# Altium project line-detector.PrjPCB
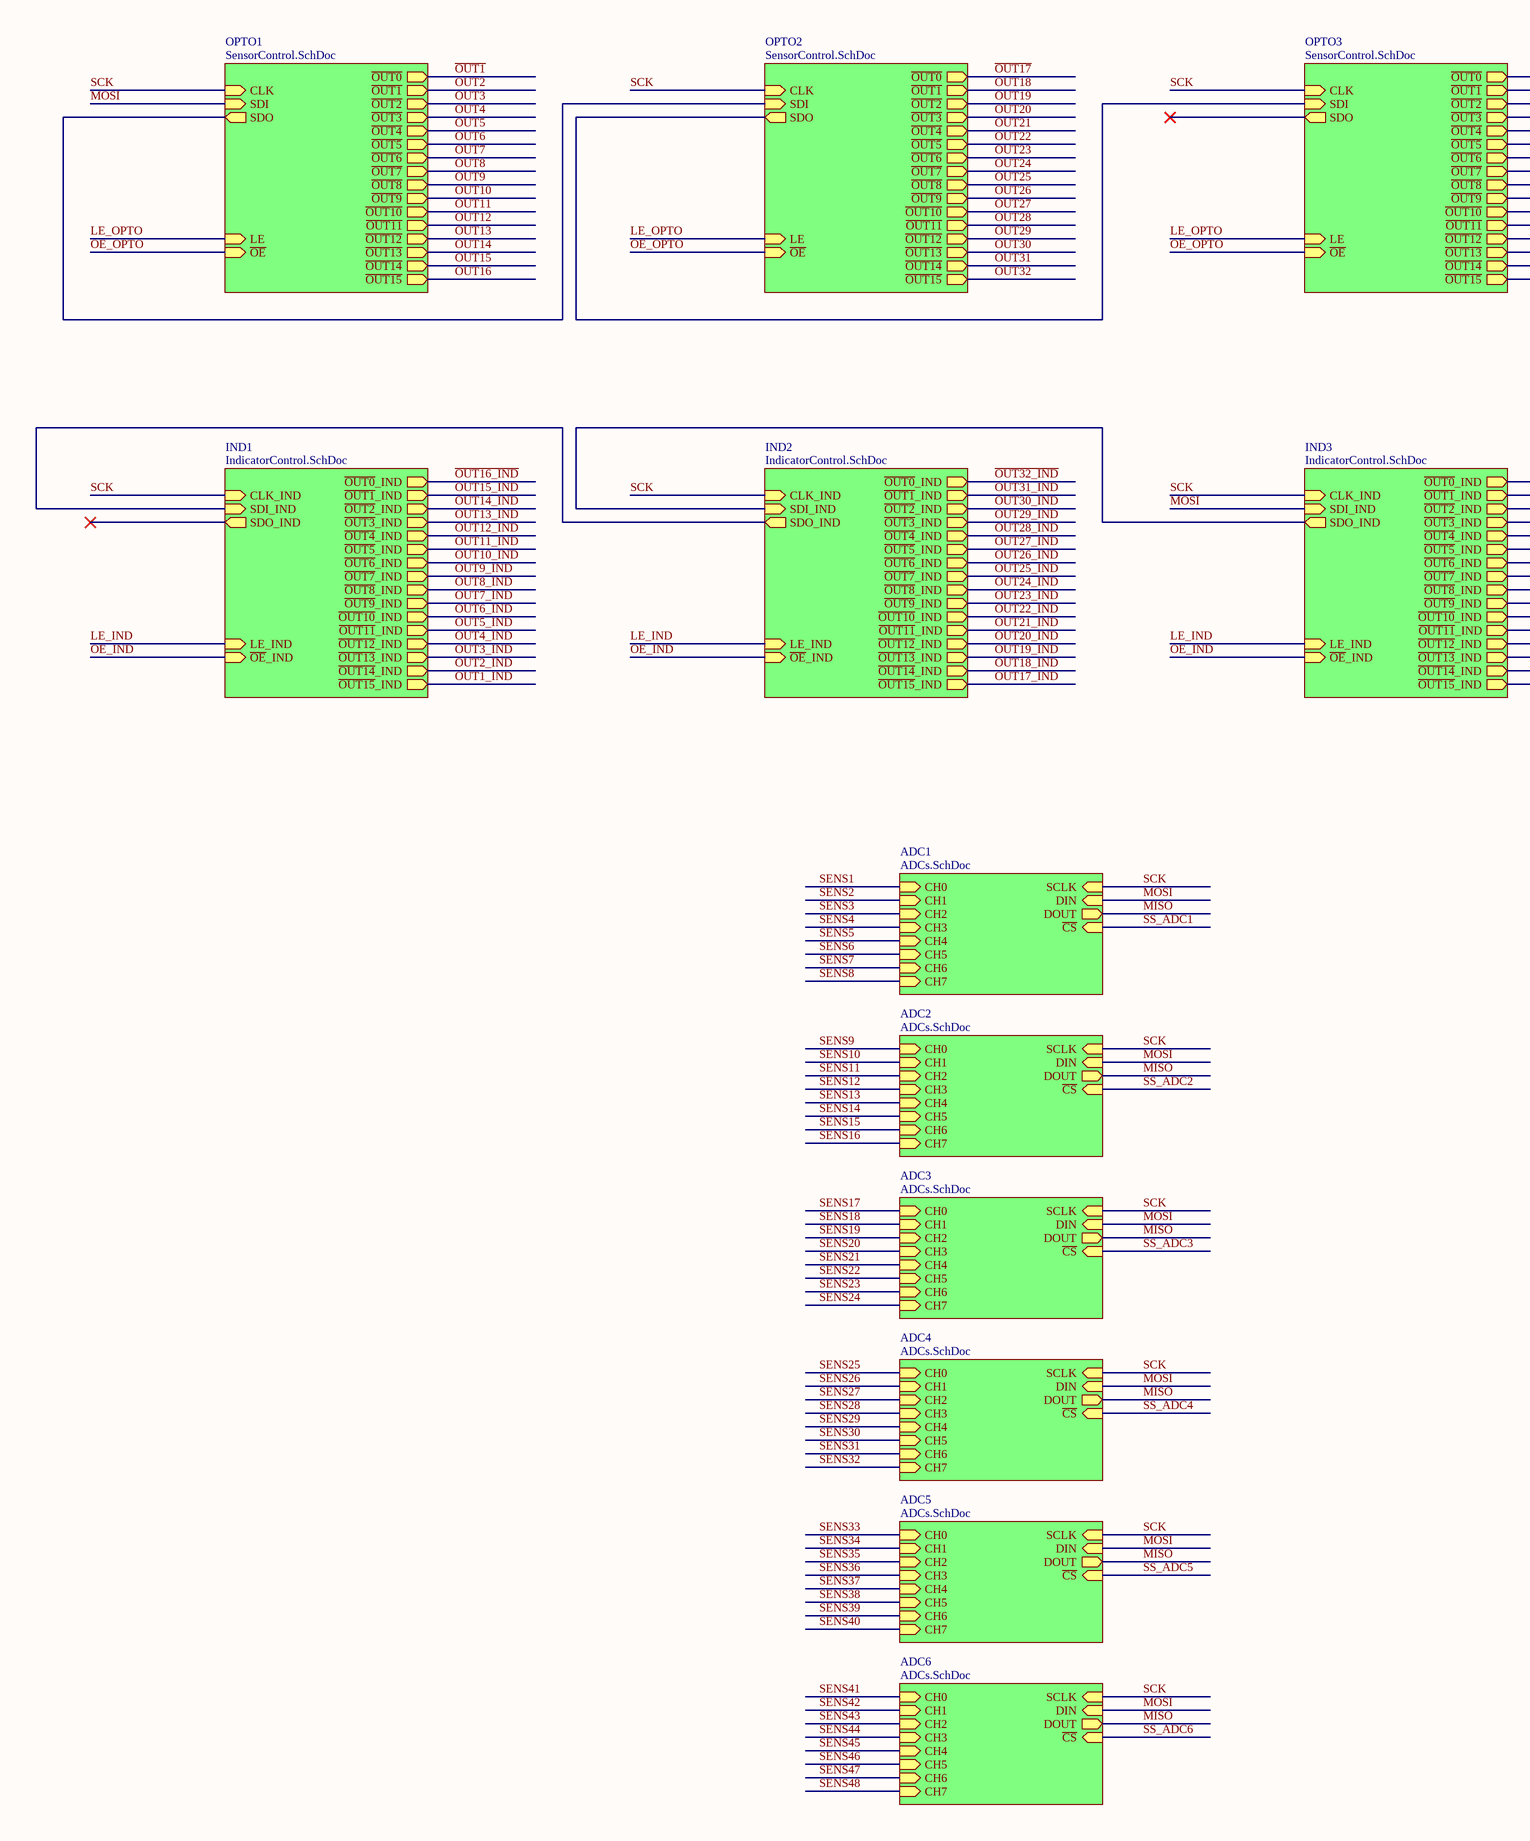
[diagram p0: Main.SchDoc, left]
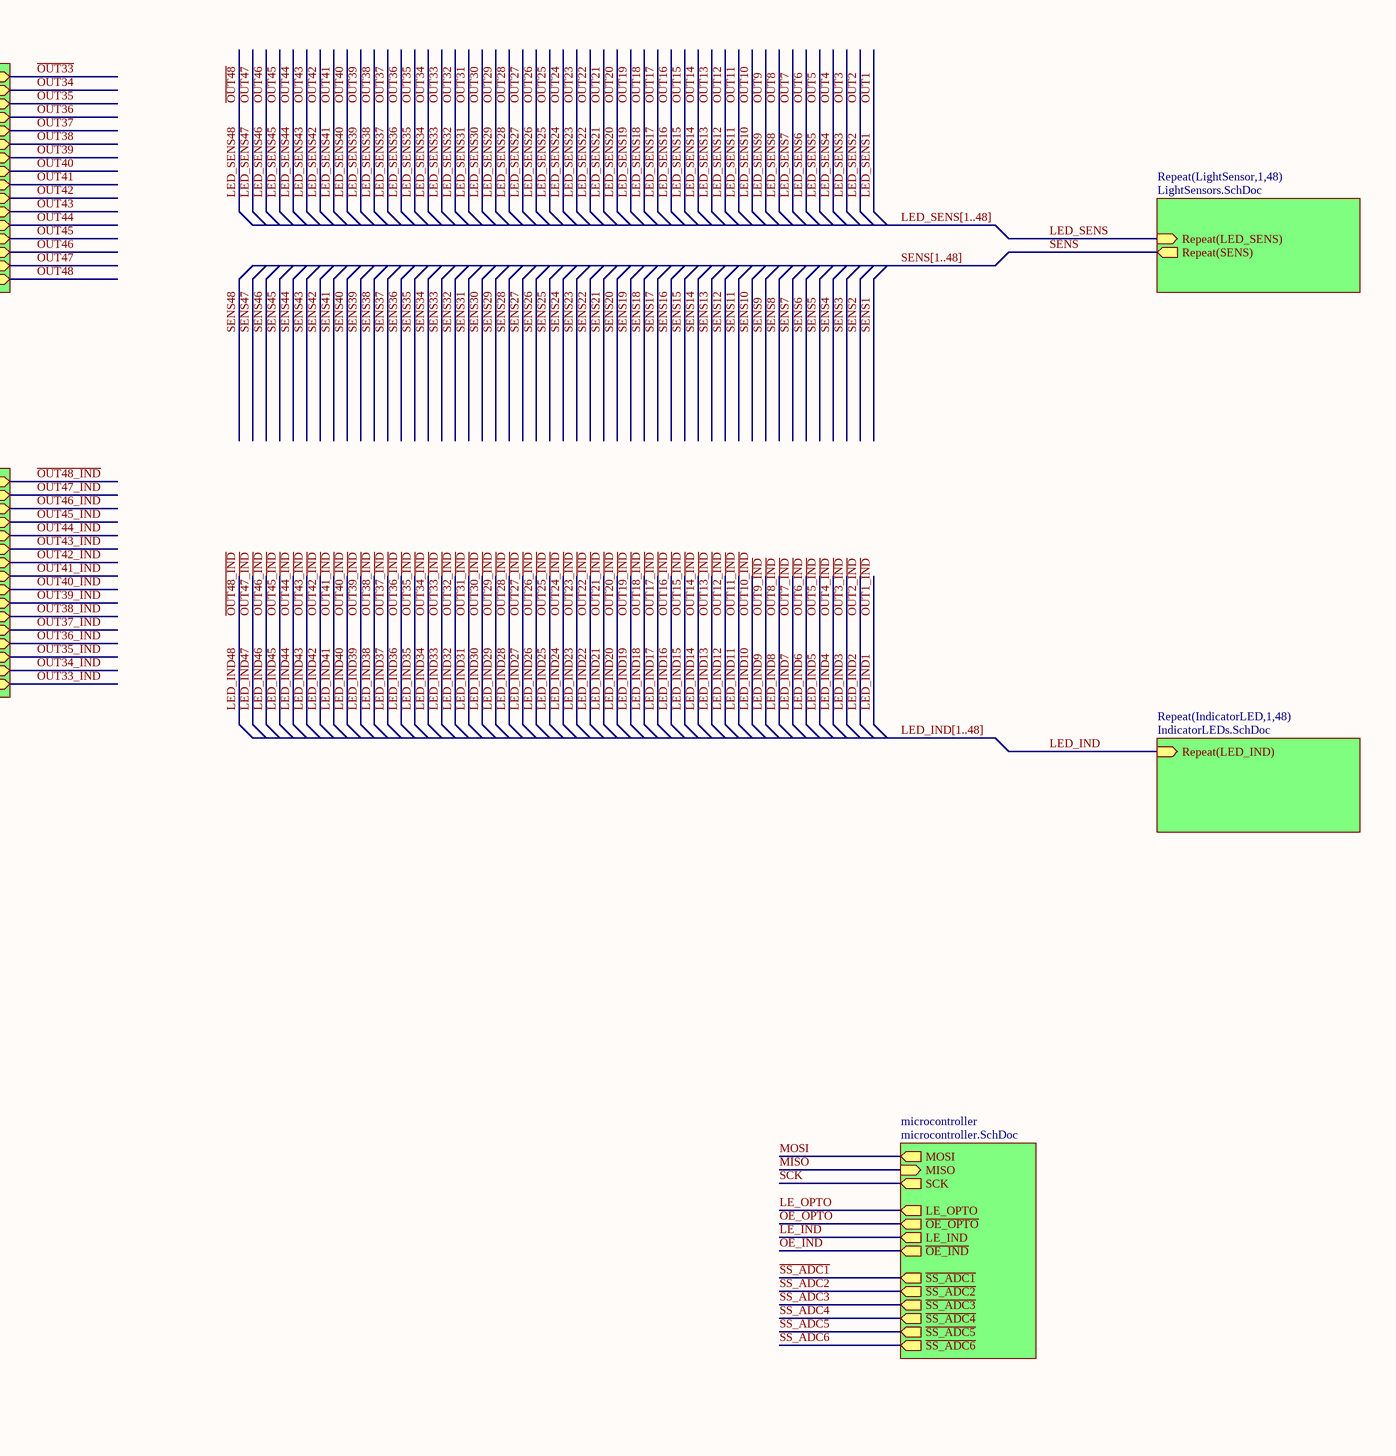
[diagram p1: Main.SchDoc, right]
6 sheets, 161 parts. Net scope: hierarchical (ports join the sheet entries above them; power ports are global).
Board file: Main.PcbDoc
Sheets:
  Main.SchDoc
    OPTO1 = SensorControl.SchDoc
    OPTO2 = SensorControl.SchDoc
    IND1 = IndicatorControl.SchDoc
    IND2 = IndicatorControl.SchDoc
    microcontroller = microcontroller.SchDoc
    ADC1 = ADCs.SchDoc
    ADC2 = ADCs.SchDoc
    ADC3 = ADCs.SchDoc
    ADC4 = ADCs.SchDoc
    LightSensor1 = LightSensors.SchDoc
    LightSensor2 = LightSensors.SchDoc
    LightSensor3 = LightSensors.SchDoc
    LightSensor4 = LightSensors.SchDoc
    LightSensor5 = LightSensors.SchDoc
    LightSensor6 = LightSensors.SchDoc
    LightSensor7 = LightSensors.SchDoc
    LightSensor8 = LightSensors.SchDoc
    LightSensor9 = LightSensors.SchDoc
    LightSensor10 = LightSensors.SchDoc
    LightSensor11 = LightSensors.SchDoc
    LightSensor12 = LightSensors.SchDoc
    LightSensor13 = LightSensors.SchDoc
    LightSensor14 = LightSensors.SchDoc
    LightSensor15 = LightSensors.SchDoc
    LightSensor16 = LightSensors.SchDoc
    LightSensor17 = LightSensors.SchDoc
    LightSensor18 = LightSensors.SchDoc
    LightSensor19 = LightSensors.SchDoc
    LightSensor20 = LightSensors.SchDoc
    LightSensor21 = LightSensors.SchDoc
    LightSensor22 = LightSensors.SchDoc
    LightSensor23 = LightSensors.SchDoc
    LightSensor24 = LightSensors.SchDoc
    LightSensor25 = LightSensors.SchDoc
    LightSensor26 = LightSensors.SchDoc
    LightSensor27 = LightSensors.SchDoc
    LightSensor28 = LightSensors.SchDoc
    LightSensor29 = LightSensors.SchDoc
    LightSensor30 = LightSensors.SchDoc
    LightSensor31 = LightSensors.SchDoc
    LightSensor32 = LightSensors.SchDoc
    LightSensor33 = LightSensors.SchDoc
    LightSensor34 = LightSensors.SchDoc
    LightSensor35 = LightSensors.SchDoc
    LightSensor36 = LightSensors.SchDoc
    LightSensor37 = LightSensors.SchDoc
    LightSensor38 = LightSensors.SchDoc
    LightSensor39 = LightSensors.SchDoc
    LightSensor40 = LightSensors.SchDoc
    LightSensor41 = LightSensors.SchDoc
    LightSensor42 = LightSensors.SchDoc
    LightSensor43 = LightSensors.SchDoc
    LightSensor44 = LightSensors.SchDoc
    LightSensor45 = LightSensors.SchDoc
    LightSensor46 = LightSensors.SchDoc
    LightSensor47 = LightSensors.SchDoc
    LightSensor48 = LightSensors.SchDoc
    OPTO3 = SensorControl.SchDoc
    IND3 = IndicatorControl.SchDoc
    ADC5 = ADCs.SchDoc
    ADC6 = ADCs.SchDoc

## Sheet Main.SchDoc
size A2

### Sub-sheets
ADC1 = ADCs.SchDoc: CH0 (in), CH1 (in), CH2 (in), CH3 (in), CH4 (in), CH5 (in), CH6 (in), CH7 (in), SCLK (in), ~{CS} (in), DIN (in), DOUT (out)
ADC2 = ADCs.SchDoc: CH0 (in), CH1 (in), CH2 (in), CH3 (in), CH4 (in), CH5 (in), CH6 (in), CH7 (in), SCLK (in), ~{CS} (in), DIN (in), DOUT (out)
ADC3 = ADCs.SchDoc: CH0 (in), CH1 (in), CH2 (in), CH3 (in), CH4 (in), CH5 (in), CH6 (in), CH7 (in), SCLK (in), ~{CS} (in), DIN (in), DOUT (out)
ADC4 = ADCs.SchDoc: CH0 (in), CH1 (in), CH2 (in), CH3 (in), CH4 (in), CH5 (in), CH6 (in), CH7 (in), SCLK (in), ~{CS} (in), DIN (in), DOUT (out)
ADC5 = ADCs.SchDoc: CH0 (in), CH1 (in), CH2 (in), CH3 (in), CH4 (in), CH5 (in), CH6 (in), CH7 (in), SCLK (in), ~{CS} (in), DIN (in), DOUT (out)
ADC6 = ADCs.SchDoc: CH0 (in), CH1 (in), CH2 (in), CH3 (in), CH4 (in), CH5 (in), CH6 (in), CH7 (in), SCLK (in), ~{CS} (in), DIN (in), DOUT (out)
IND1 = IndicatorControl.SchDoc: ~{OUT0}_IND (out), ~{OUT1}_IND (out), ~{OUT2}_IND (out), ~{OUT3}_IND (out), ~{OUT4}_IND (out), ~{OUT5}_IND (out), ~{OUT6}_IND (out), ~{OUT7}_IND (out), ~{OUT8}_IND (out), ~{OUT9}_IND (out), ~{OUT10}_IND (out), ~{OUT11}_IND (out), ~{OUT12}_IND (out), ~{OUT13}_IND (out), ~{OUT14}_IND (out), ~{OUT15}_IND (out), SDI_IND (in), ~{OE}_IND (in), CLK_IND (in), LE_IND (in), SDO_IND (out)
IND2 = IndicatorControl.SchDoc: ~{OUT0}_IND (out), ~{OUT1}_IND (out), ~{OUT2}_IND (out), ~{OUT3}_IND (out), ~{OUT4}_IND (out), ~{OUT5}_IND (out), ~{OUT6}_IND (out), ~{OUT7}_IND (out), ~{OUT8}_IND (out), ~{OUT9}_IND (out), ~{OUT10}_IND (out), ~{OUT11}_IND (out), ~{OUT12}_IND (out), ~{OUT13}_IND (out), ~{OUT14}_IND (out), ~{OUT15}_IND (out), SDI_IND (in), ~{OE}_IND (in), CLK_IND (in), LE_IND (in), SDO_IND (out)
IND3 = IndicatorControl.SchDoc: ~{OUT0}_IND (out), ~{OUT1}_IND (out), ~{OUT2}_IND (out), ~{OUT3}_IND (out), ~{OUT4}_IND (out), ~{OUT5}_IND (out), ~{OUT6}_IND (out), ~{OUT7}_IND (out), ~{OUT8}_IND (out), ~{OUT9}_IND (out), ~{OUT10}_IND (out), ~{OUT11}_IND (out), ~{OUT12}_IND (out), ~{OUT13}_IND (out), ~{OUT14}_IND (out), ~{OUT15}_IND (out), SDI_IND (in), ~{OE}_IND (in), CLK_IND (in), LE_IND (in), SDO_IND (out)
microcontroller = microcontroller.SchDoc: LE_IND (out), ~{OE_IND} (out), ~{SS_ADC4} (out), LE_OPTO (out), ~{SS_ADC3} (out), MOSI (out), SCK (out), ~{OE_OPTO} (out), ~{SS_ADC1} (out), ~{SS_ADC2} (out), MISO (in), ~{SS_ADC5} (out), ~{SS_ADC6} (out)
OPTO1 = SensorControl.SchDoc: ~{OUT0} (out), ~{OUT1} (out), ~{OUT2} (out), ~{OUT3} (out), ~{OUT4} (out), ~{OUT5} (out), ~{OUT6} (out), ~{OUT7} (out), ~{OUT8} (out), ~{OUT9} (out), ~{OUT10} (out), ~{OUT11} (out), ~{OUT12} (out), ~{OUT13} (out), ~{OUT14} (out), ~{OUT15} (out), SDI (in), ~{OE} (in), CLK (in), LE (in), SDO (out)
OPTO2 = SensorControl.SchDoc: ~{OUT0} (out), ~{OUT1} (out), ~{OUT2} (out), ~{OUT3} (out), ~{OUT4} (out), ~{OUT5} (out), ~{OUT6} (out), ~{OUT7} (out), ~{OUT8} (out), ~{OUT9} (out), ~{OUT10} (out), ~{OUT11} (out), ~{OUT12} (out), ~{OUT13} (out), ~{OUT14} (out), ~{OUT15} (out), SDI (in), ~{OE} (in), CLK (in), LE (in), SDO (out)
OPTO3 = SensorControl.SchDoc: ~{OUT0} (out), ~{OUT1} (out), ~{OUT2} (out), ~{OUT3} (out), ~{OUT4} (out), ~{OUT5} (out), ~{OUT6} (out), ~{OUT7} (out), ~{OUT8} (out), ~{OUT9} (out), ~{OUT10} (out), ~{OUT11} (out), ~{OUT12} (out), ~{OUT13} (out), ~{OUT14} (out), ~{OUT15} (out), SDI (in), ~{OE} (in), CLK (in), LE (in), SDO (out)
Repeat(IndicatorLED,1,48) = IndicatorLEDs.SchDoc (file not in this document): Repeat(LED_IND) (in)
Repeat(LightSensor,1,48) = LightSensors.SchDoc: Repeat(SENS) (out), Repeat(LED_SENS) (in)

### Nets
LE_IND: sheet IND1/LE_IND, sheet IND2/LE_IND, sheet microcontroller/LE_IND, sheet IND3/LE_IND
LE_OPTO: sheet OPTO1/LE, sheet OPTO2/LE, sheet microcontroller/LE_OPTO, sheet OPTO3/LE
LED_IND: sheet Repeat(IndicatorLED,1,48)/Repeat(LED_IND)
LED_SENS: sheet Repeat(LightSensor,1,48)/Repeat(LED_SENS)
MISO: sheet microcontroller/MISO, sheet ADC1/DOUT, sheet ADC2/DOUT, sheet ADC3/DOUT, sheet ADC4/DOUT, sheet ADC5/DOUT, sheet ADC6/DOUT
MOSI: sheet OPTO1/SDI, sheet microcontroller/MOSI, sheet ADC1/DIN, sheet ADC2/DIN, sheet ADC3/DIN, sheet ADC4/DIN, sheet IND3/SDI_IND, sheet ADC5/DIN, sheet ADC6/DIN
~{OE_IND}: sheet IND1/~{OE}_IND, sheet IND2/~{OE}_IND, sheet microcontroller/~{OE_IND}, sheet IND3/~{OE}_IND
~{OE_OPTO}: sheet OPTO1/~{OE}, sheet OPTO2/~{OE}, sheet microcontroller/~{OE_OPTO}, sheet OPTO3/~{OE}
~{SS_ADC1}: sheet microcontroller/~{SS_ADC1}, sheet ADC1/~{CS}
~{SS_ADC2}: sheet microcontroller/~{SS_ADC2}, sheet ADC2/~{CS}
~{SS_ADC3}: sheet microcontroller/~{SS_ADC3}, sheet ADC3/~{CS}
~{SS_ADC4}: sheet microcontroller/~{SS_ADC4}, sheet ADC4/~{CS}
~{SS_ADC5}: sheet microcontroller/~{SS_ADC5}, sheet ADC5/~{CS}
~{SS_ADC6}: sheet microcontroller/~{SS_ADC6}, sheet ADC6/~{CS}
SCK: sheet OPTO1/CLK, sheet OPTO2/CLK, sheet IND1/CLK_IND, sheet IND2/CLK_IND, sheet microcontroller/SCK, sheet ADC1/SCLK, sheet ADC2/SCLK, sheet ADC3/SCLK, sheet ADC4/SCLK, sheet OPTO3/CLK, sheet IND3/CLK_IND, sheet ADC5/SCLK, sheet ADC6/SCLK
SENS: sheet Repeat(LightSensor,1,48)/Repeat(SENS)
NetIND1_2: sheet IND1/SDI_IND, sheet IND2/SDO_IND
NetIND2_2: sheet IND2/SDI_IND, sheet IND3/SDO_IND
NetOPTO1_22: sheet OPTO1/SDO, sheet OPTO2/SDI
NetOPTO2_22: sheet OPTO2/SDO, sheet OPTO3/SDI

### Buses and harness runs
bus LED_IND[1..48]
bus LED_SENS[1..48]
bus SENS[1..48]

## Sheet SensorControl.SchDoc
size A4
Used 3 times, as channels OPTO1, OPTO2, OPTO3. Parts and nets are listed once, with the designators drawn on the sheet.
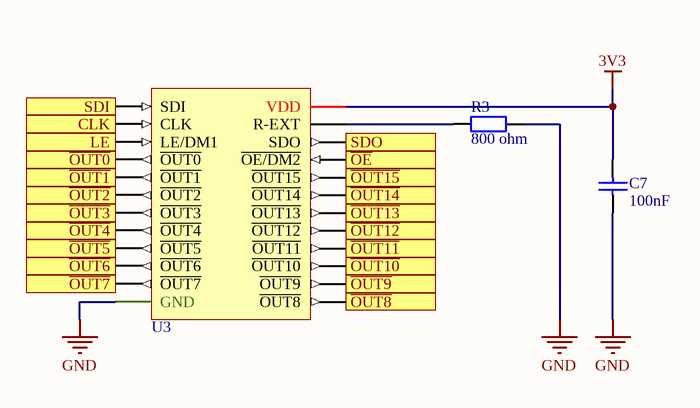
[diagram p2: SensorControl.SchDoc]

### Parts
C7  100nF  [FP_0805_CAP_085]
R3  Resistance: 800 ohm  [0805-W]  (hidden comment: CRCW0805806RFKEA)
U3  STP16CP05TTR  [24-Pin TSSOP]  (value not drawn)

### Ports
CLK (in), LE (in), SDI (in), SDO (out), ~{OE} (in), ~{OUT0} (out), ~{OUT1} (out), ~{OUT2} (out), ~{OUT3} (out), ~{OUT4} (out), ~{OUT5} (out), ~{OUT6} (out), ~{OUT7} (out), ~{OUT8} (out), ~{OUT9} (out), ~{OUT10} (out), ~{OUT11} (out), ~{OUT12} (out), ~{OUT13} (out), ~{OUT14} (out), ~{OUT15} (out)

### Nets
3V3: C7.2 U3.24(VDD)
GND: C7.1 R3.2 U3.1(GND)
CLK: U3.3(CLK) ; port CLK
LE: U3.4(LE/DM1) ; port LE
~{OE}: U3.21(~{OE/DM2}) ; port ~{OE}
~{OUT0}: U3.5(~{OUT0}) ; port ~{OUT0}
~{OUT1}: U3.6(~{OUT1}) ; port ~{OUT1}
~{OUT10}: U3.15(~{OUT10}) ; port ~{OUT10}
~{OUT11}: U3.16(~{OUT11}) ; port ~{OUT11}
~{OUT12}: U3.17(~{OUT12}) ; port ~{OUT12}
~{OUT13}: U3.18(~{OUT13}) ; port ~{OUT13}
~{OUT14}: U3.19(~{OUT14}) ; port ~{OUT14}
~{OUT15}: U3.20(~{OUT15}) ; port ~{OUT15}
~{OUT2}: U3.7(~{OUT2}) ; port ~{OUT2}
~{OUT3}: U3.8(~{OUT3}) ; port ~{OUT3}
~{OUT4}: U3.9(~{OUT4}) ; port ~{OUT4}
~{OUT5}: U3.10(~{OUT5}) ; port ~{OUT5}
~{OUT6}: U3.11(~{OUT6}) ; port ~{OUT6}
~{OUT7}: U3.12(~{OUT7}) ; port ~{OUT7}
~{OUT8}: U3.13(~{OUT8}) ; port ~{OUT8}
~{OUT9}: U3.14(~{OUT9}) ; port ~{OUT9}
SDI: U3.2(SDI) ; port SDI
SDO: U3.22(SDO) ; port SDO
NetR3_1: R3.1 U3.23(R-EXT)

### Channels
OPTO1: designators C7=C7#1 R3=R3#1 U3=OPTO1; ports CLK=SCK LE=LE_OPTO SDI=MOSI SDO=NetOPTO1_22 ~{OE}=~{OE_OPTO} ~{OUT0}=LED_SENS1 ~{OUT1}=LED_SENS2 ~{OUT2}=LED_SENS3 ~{OUT3}=LED_SENS4 ~{OUT4}=LED_SENS5 ~{OUT5}=LED_SENS6 ~{OUT6}=LED_SENS7 ~{OUT7}=LED_SENS8 ~{OUT8}=LED_SENS9 ~{OUT9}=LED_SENS10 ~{OUT10}=LED_SENS11 ~{OUT11}=LED_SENS12 ~{OUT12}=LED_SENS13 ~{OUT13}=LED_SENS14 ~{OUT14}=LED_SENS15 ~{OUT15}=LED_SENS16
OPTO2: designators C7=C7#2 R3=R3#2 U3=OPTO2; ports CLK=SCK LE=LE_OPTO SDI=NetOPTO1_22 SDO=NetOPTO2_22 ~{OE}=~{OE_OPTO} ~{OUT0}=LED_SENS17 ~{OUT1}=LED_SENS18 ~{OUT2}=LED_SENS19 ~{OUT3}=LED_SENS20 ~{OUT4}=LED_SENS21 ~{OUT5}=LED_SENS22 ~{OUT6}=LED_SENS23 ~{OUT7}=LED_SENS24 ~{OUT8}=LED_SENS25 ~{OUT9}=LED_SENS26 ~{OUT10}=LED_SENS27 ~{OUT11}=LED_SENS28 ~{OUT12}=LED_SENS29 ~{OUT13}=LED_SENS30 ~{OUT14}=LED_SENS31 ~{OUT15}=LED_SENS32
OPTO3: designators C7=C7#3 R3=R3#3 U3=OPTO3; ports CLK=SCK LE=LE_OPTO SDI=NetOPTO2_22 SDO=NetOPTO3_22 ~{OE}=~{OE_OPTO} ~{OUT0}=LED_SENS33 ~{OUT1}=LED_SENS34 ~{OUT2}=LED_SENS35 ~{OUT3}=LED_SENS36 ~{OUT4}=LED_SENS37 ~{OUT5}=LED_SENS38 ~{OUT6}=LED_SENS39 ~{OUT7}=LED_SENS40 ~{OUT8}=LED_SENS41 ~{OUT9}=LED_SENS42 ~{OUT10}=LED_SENS43 ~{OUT11}=LED_SENS44 ~{OUT12}=LED_SENS45 ~{OUT13}=LED_SENS46 ~{OUT14}=LED_SENS47 ~{OUT15}=LED_SENS48

### Library data of the parts
C7 = CAP 100nF: Capacitor; Tolerance: +80%/-20%; Voltage: 25V; Reference: 1759167; Name: SMD Multilayer Ceramic Capacitor, 0805; Supplier: Farnell; Value: 100nF
R3 = CRCW0805806RFKEA: RES, THICK FILM, 806R, 1%, 0.125W, 0805
U3 = STP16CP05TTR: Led Driver, 16 Outputs, Constant Current, 3V-5.5V in, 30MHz switch, 20V/100mA out, TSSOP-24

## Sheet IndicatorControl.SchDoc
size A4
Used 3 times, as channels IND1, IND2, IND3. Parts and nets are listed once, with the designators drawn on the sheet.
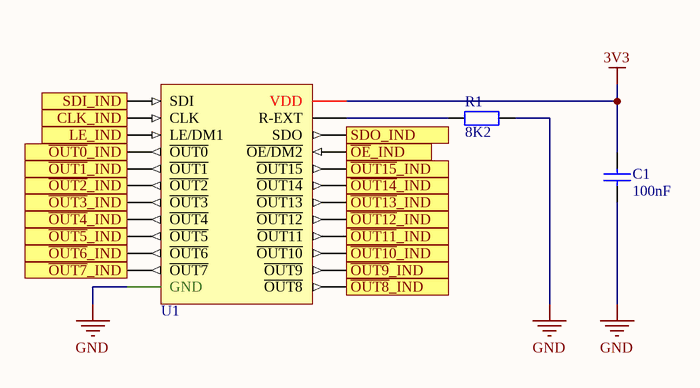
[diagram p3: IndicatorControl.SchDoc]

### Parts
C1  100nF  [FP_0805_CAP_085]
R1  8K2  [FP_0805_RES]
U1  STP16CP05TTR  [24-Pin TSSOP]  (value not drawn)

### Ports
CLK_IND (in), LE_IND (in), SDI_IND (in), SDO_IND (out), ~{OE}_IND (in), ~{OUT0}_IND (out), ~{OUT1}_IND (out), ~{OUT2}_IND (out), ~{OUT3}_IND (out), ~{OUT4}_IND (out), ~{OUT5}_IND (out), ~{OUT6}_IND (out), ~{OUT7}_IND (out), ~{OUT8}_IND (out), ~{OUT9}_IND (out), ~{OUT10}_IND (out), ~{OUT11}_IND (out), ~{OUT12}_IND (out), ~{OUT13}_IND (out), ~{OUT14}_IND (out), ~{OUT15}_IND (out)

### Nets
3V3: C1.2 U1.24(VDD)
GND: C1.1 R1.2 U1.1(GND)
CLK_IND: U1.3(CLK) ; port CLK_IND
LE_IND: U1.4(LE/DM1) ; port LE_IND
~{OE}_IND: U1.21(~{OE/DM2}) ; port ~{OE}_IND
~{OUT0}_IND: U1.5(~{OUT0}) ; port ~{OUT0}_IND
~{OUT10}_IND: U1.15(~{OUT10}) ; port ~{OUT10}_IND
~{OUT11}_IND: U1.16(~{OUT11}) ; port ~{OUT11}_IND
~{OUT12}_IND: U1.17(~{OUT12}) ; port ~{OUT12}_IND
~{OUT13}_IND: U1.18(~{OUT13}) ; port ~{OUT13}_IND
~{OUT14}_IND: U1.19(~{OUT14}) ; port ~{OUT14}_IND
~{OUT15}_IND: U1.20(~{OUT15}) ; port ~{OUT15}_IND
~{OUT1}_IND: U1.6(~{OUT1}) ; port ~{OUT1}_IND
~{OUT2}_IND: U1.7(~{OUT2}) ; port ~{OUT2}_IND
~{OUT3}_IND: U1.8(~{OUT3}) ; port ~{OUT3}_IND
~{OUT4}_IND: U1.9(~{OUT4}) ; port ~{OUT4}_IND
~{OUT5}_IND: U1.10(~{OUT5}) ; port ~{OUT5}_IND
~{OUT6}_IND: U1.11(~{OUT6}) ; port ~{OUT6}_IND
~{OUT7}_IND: U1.12(~{OUT7}) ; port ~{OUT7}_IND
~{OUT8}_IND: U1.13(~{OUT8}) ; port ~{OUT8}_IND
~{OUT9}_IND: U1.14(~{OUT9}) ; port ~{OUT9}_IND
SDI_IND: U1.2(SDI) ; port SDI_IND
SDO_IND: U1.22(SDO) ; port SDO_IND
NetR1_1: R1.1 U1.23(R-EXT)

### Channels
IND1: designators C1=C1#1 R1=R1#1 U1=IND1; ports CLK_IND=SCK LE_IND=LE_IND SDI_IND=NetIND1_2 SDO_IND=NetIND1_22 ~{OE}_IND=~{OE_IND} ~{OUT0}_IND=LED_IND16 ~{OUT1}_IND=LED_IND15 ~{OUT2}_IND=LED_IND14 ~{OUT3}_IND=LED_IND13 ~{OUT4}_IND=LED_IND12 ~{OUT5}_IND=LED_IND11 ~{OUT6}_IND=LED_IND10 ~{OUT7}_IND=LED_IND9 ~{OUT8}_IND=LED_IND8 ~{OUT9}_IND=LED_IND7 ~{OUT10}_IND=LED_IND6 ~{OUT11}_IND=LED_IND5 ~{OUT12}_IND=LED_IND4 ~{OUT13}_IND=LED_IND3 ~{OUT14}_IND=LED_IND2 ~{OUT15}_IND=LED_IND1
IND2: designators C1=C1#2 R1=R1#2 U1=IND2; ports CLK_IND=SCK LE_IND=LE_IND SDI_IND=NetIND2_2 SDO_IND=NetIND1_2 ~{OE}_IND=~{OE_IND} ~{OUT0}_IND=LED_IND32 ~{OUT1}_IND=LED_IND31 ~{OUT2}_IND=LED_IND30 ~{OUT3}_IND=LED_IND29 ~{OUT4}_IND=LED_IND28 ~{OUT5}_IND=LED_IND27 ~{OUT6}_IND=LED_IND26 ~{OUT7}_IND=LED_IND25 ~{OUT8}_IND=LED_IND24 ~{OUT9}_IND=LED_IND23 ~{OUT10}_IND=LED_IND22 ~{OUT11}_IND=LED_IND21 ~{OUT12}_IND=LED_IND20 ~{OUT13}_IND=LED_IND19 ~{OUT14}_IND=LED_IND18 ~{OUT15}_IND=LED_IND17
IND3: designators C1=C1#3 R1=R1#3 U1=IND3; ports CLK_IND=SCK LE_IND=LE_IND SDI_IND=MOSI SDO_IND=NetIND2_2 ~{OE}_IND=~{OE_IND} ~{OUT0}_IND=LED_IND48 ~{OUT1}_IND=LED_IND47 ~{OUT2}_IND=LED_IND46 ~{OUT3}_IND=LED_IND45 ~{OUT4}_IND=LED_IND44 ~{OUT5}_IND=LED_IND43 ~{OUT6}_IND=LED_IND42 ~{OUT7}_IND=LED_IND41 ~{OUT8}_IND=LED_IND40 ~{OUT9}_IND=LED_IND39 ~{OUT10}_IND=LED_IND38 ~{OUT11}_IND=LED_IND37 ~{OUT12}_IND=LED_IND36 ~{OUT13}_IND=LED_IND35 ~{OUT14}_IND=LED_IND34 ~{OUT15}_IND=LED_IND33

### Library data of the parts
C1 = CAP 100nF: as C7 on sheet SensorControl; Supplier: Farnell; Value: 100nF
R1 = RES 8K2: Resistor; Tolerance: 5%; Power: 125mW; Name: YAGEO (PHYCOMP)  RC0805JR-078K2L  SMD Chip Resistor, Thick Film, 8.2 kohm; Reference: 9234128; Supplier: Farnell; Value: 8K2
U1 = STP16CP05TTR: as U3 on sheet SensorControl

## Sheet microcontroller.SchDoc
size A
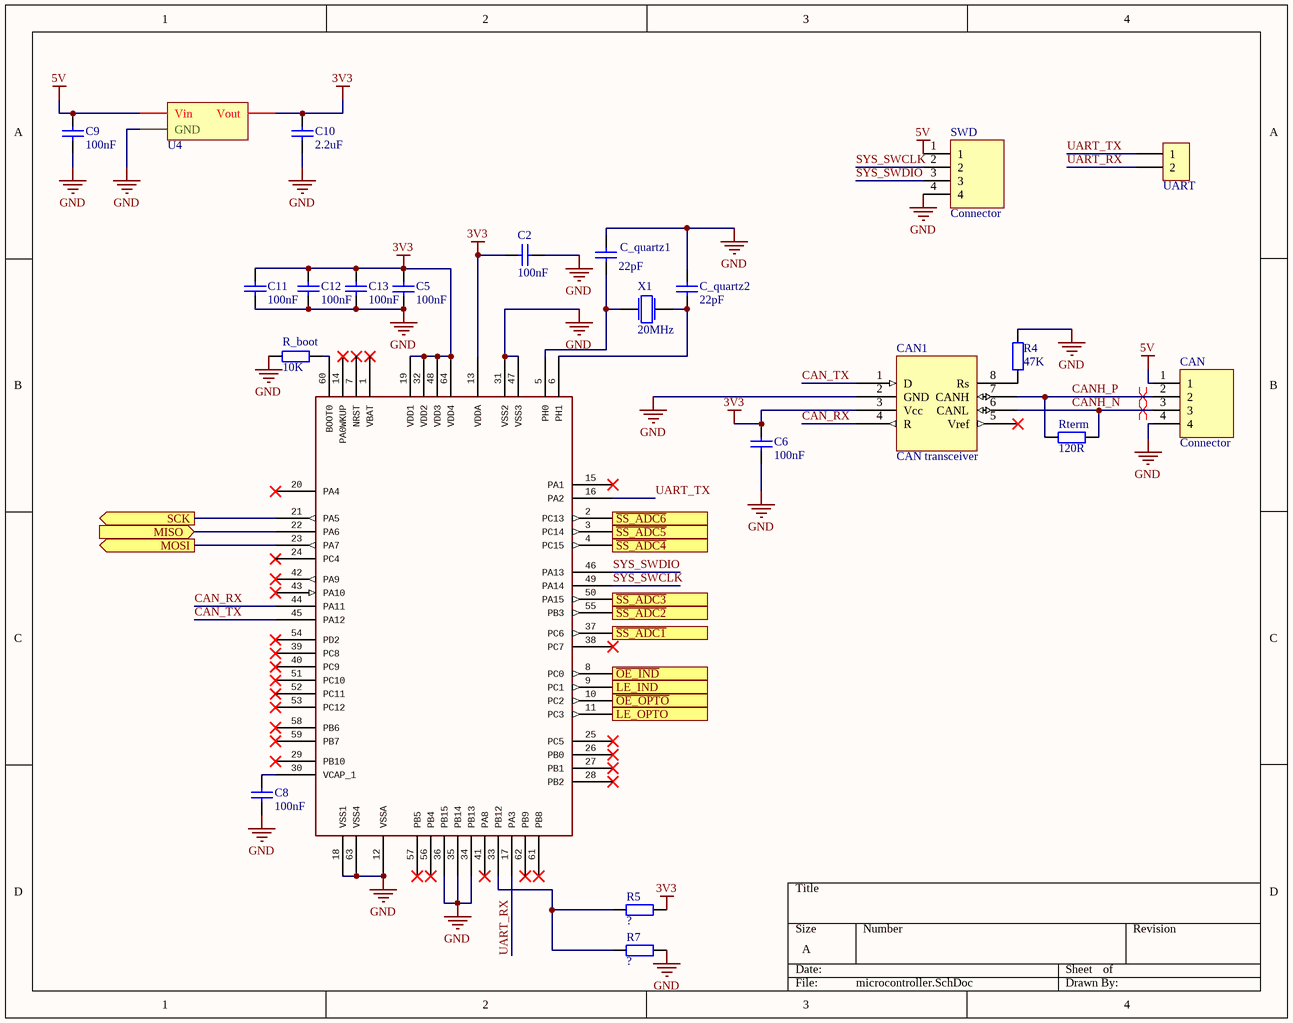
[diagram p4: microcontroller.SchDoc]

### Parts
(Parts that share a designator on the sheet are numbered #1, #2 ... from top to bottom, then left to right.)
1#1  64-pin STM32F4 chip with symbol for Foxcar Control Board v1.  [LQFP64]  (value not drawn)
C2  100nF  [FP_0805_CAP_085]
C5  100nF  [FP_0805_CAP_085]
C6  100nF  [FP_0805_CAP_085]
C8  100nF  [FP_0805_CAP_085]
C9  100nF  [FP_0805_CAP_085]
C10  2.2uF  [FP_0805_CAP_085]
C11  100nF  [FP_0805_CAP_085]
C12  100nF  [FP_0805_CAP_085]
C13  100nF  [FP_0805_CAP_085]
C_quartz1  22pF  [FP_0805_CAP_085]
C_quartz2  22pF  [FP_0805_CAP_085]
CAN  Connector  [FP_CONN4_TUSKE_254MM]
CAN1  CAN transceiver  [SOIC-8]
R4  47K  [FP_0805_RES]
R5  0Ohm  [FP_0805_RES]  (value not drawn)
R7  0Ohm  [FP_0805_RES]  (value not drawn)
R_boot  10K  [FP_0805_RES]
Rterm  120R  [FP_0805_RES]
SWD  Connector  [FP_CONN4_TUSKE_254MM]
U4  LF33CDT-TRY  [DPAK]  (value not drawn)
UART  2-Pin HEADER  [2-Pin Header]  (value not drawn)
X1  20MHz  [FP_CRYSTAL_HC49_SMD]

### Ports
LE_IND (out), LE_OPTO (out), MISO (in), MOSI (out), SCK (out), ~{OE_IND} (out), ~{OE_OPTO} (out), ~{SS_ADC1} (out), ~{SS_ADC2} (out), ~{SS_ADC3} (out), ~{SS_ADC4} (out), ~{SS_ADC5} (out), ~{SS_ADC6} (out)

### Nets
3V3: 1#1.13(VDDA) 1#1.19(VDD1) 1#1.32(VDD2) 1#1.48(VDD3) 1#1.64(VDD4) C2.2 C5.2 C6.1 C10.2 C11.2 C12.2 C13.2 CAN1.3(Vcc) R5.2 U4.S(Vout)
5V: C9.2 CAN.1 SWD.1 U4.G(Vin)
GND: 1#1.12(VSSA) 1#1.18(VSS1) 1#1.31(VSS2) 1#1.34(PB13) 1#1.35(PB14) 1#1.36(PB15) 1#1.47(VSS3) 1#1.63(VSS4) C2.1 C5.1 C6.2 C8.1 C9.1 C10.1 C11.1 C12.1 C13.1 C_quartz1.1 C_quartz2.1 CAN.4 CAN1.2(GND) R4.2 R7.2 R_boot.1 SWD.4 U4.D(GND)
CAN_RX: 1#1.44(PA11) CAN1.4(R)
CAN_TX: 1#1.45(PA12) CAN1.1(D)
CANH_N: CAN.3 CAN1.6(CANL) Rterm.2
CANH_P: CAN.2 CAN1.7(CANH) Rterm.1
LE_IND: 1#1.9(PC1) ; port LE_IND
LE_OPTO: 1#1.11(PC3) ; port LE_OPTO
MISO: 1#1.22(PA6) ; port MISO
MOSI: 1#1.23(PA7) ; port MOSI
~{OE_IND}: 1#1.8(PC0) ; port ~{OE_IND}
~{OE_OPTO}: 1#1.10(PC2) ; port ~{OE_OPTO}
~{SS_ADC1}: 1#1.37(PC6) ; port ~{SS_ADC1}
~{SS_ADC2}: 1#1.55(PB3) ; port ~{SS_ADC2}
~{SS_ADC3}: 1#1.50(PA15) ; port ~{SS_ADC3}
~{SS_ADC4}: 1#1.4(PC15) ; port ~{SS_ADC4}
~{SS_ADC5}: 1#1.3(PC14) ; port ~{SS_ADC5}
~{SS_ADC6}: 1#1.2(PC13) ; port ~{SS_ADC6}
SCK: 1#1.21(PA5) ; port SCK
SYS_SWCLK: 1#1.49(PA14) SWD.2
SYS_SWDIO: 1#1.46(PA13) SWD.3
UART_RX: 1#1.17(PA3) UART.2
UART_TX: 1#1.16(PA2) UART.1
Net1#1_5: 1#1.5(PH0) C_quartz1.2 X1.1
Net1#1_6: 1#1.6(PH1) C_quartz2.2 X1.2
Net1#1_30: 1#1.30(VCAP_1) C8.2
Net1#1_33: 1#1.33(PB12) R5.1 R7.1
Net1#1_60: 1#1.60(BOOT0) R_boot.2
NetCAN1_8: CAN1.8(Rs) R4.1

Not connected (* = marked no-connect by the designer): 1#1 1(VBAT)* 7(NRST)* 14(PA0WKUP)* 15(PA1)* 20(PA4)* 24(PC4)* 25(PC5)* 26(PB0)* 27(PB1)* 28(PB2)* 29(PB10)* 38(PC7)* 39(PC8)* 40(PC9)* 41(PA8)* 42(PA9)* 43(PA10)* 51(PC10)* 52(PC11)* 53(PC12)* 54(PD2)* 56(PB4)* 57(PB5)* 58(PB6)* 59(PB7)* 61(PB8)* 62(PB9)*; CAN1 5(Vref)*

### Layout directives
differential pair: CANH_N, CANH_P

### Library data of the parts
1#1 = STM32F4R_64PIN_FOXCAR: GateName_1: G$1; SymbolName_1: STM32F4_64PINS_FOXCARV1; LibraryName: stm32f4; DeviceSetName: STM32F4R_64PIN_FOXCAR; Package: LQFP64
C2 C5 C6 C8-C13 = CAP 100nF: as C7 on sheet SensorControl; Supplier: Farnell
  C2 C5 C6 C8 C9 C11-C13: Value: 100nF
  C10: Value: 2.2uF
C_quartz1 C_quartz2 = CAP 22pF: Capacitor; Tolerance: 5%; Voltage: 50V; Reference: 1759195; Name: SMD Multilayer Ceramic Capacitor, 0805; Supplier: Farnell; Value: 22pF
CAN SWD = Connector_4pin: 4pin Connector
CAN1 = SN65HVD230
R4 = RES 47K: Resistor; Tolerance: 5%; Power: 125mW; Name: YAGEO (PHYCOMP)  RC0805JR-0747KL  SMD Chip Resistor, Thick Film, 47 kohm; Reference: 9234217; Supplier: Farnell; Value: 47K
R5 R7 = RES: Resistor; Value: ?
R_boot = RES 10K: Resistor; Tolerance: 5%; Power: 125mW; Name: YAGEO (PHYCOMP)  RC0805JR-0710KL  SMD Chip Resistor, Thick Film, 10 kohm; Reference: 9234136; Supplier: Farnell; Value: 10K
Rterm = RES 120R: Resistor; Tolerance: 5%; Power: 125mW; Name: YAGEO (PHYCOMP)  RC0805JR-07120RL  SMD Chip Resistor, Thick Film, 120 ohm; Reference: 9233890; Supplier: Farnell; Value: 120R
U4 = LF33CDT-TRY: Linear Voltage Regulators VLDV Reg Inhibit 0.45V 50uA 500mA 3.3V
X1 = Crystal: Quarz Crystal; Value: 8MHz

## Sheet ADCs.SchDoc
size A4
Used 6 times, as channels ADC1, ADC2, ADC3, ADC4, ADC5, ADC6. Parts and nets are listed once, with the designators drawn on the sheet.
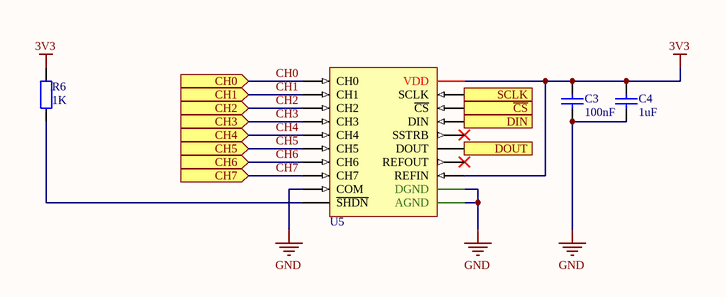
[diagram p5: ADCs.SchDoc]

### Parts
C3  100nF  [FP_0805_CAP_085]
C4  1uF  [FP_0805_CAP_085]
R6  1K  [FP_0805_RES]
U5  MAX1110CAP+  [20-Pin SSOP]  (value not drawn)

### Ports
CH0 (in), CH1 (in), CH2 (in), CH3 (in), CH4 (in), CH5 (in), CH6 (in), CH7 (in), DIN (in), DOUT (out), SCLK (in), ~{CS} (in)

### Nets
3V3: C3.2 C4.2 R6.2 U5.11(REFIN) U5.20(VDD)
GND: C3.1 C4.1 U5.9(COM) U5.13(AGND) U5.14(DGND)
~{CS}: U5.18(~{CS}) ; port ~{CS}
CH0: U5.1(CH0) ; port CH0
CH1: U5.2(CH1) ; port CH1
CH2: U5.3(CH2) ; port CH2
CH3: U5.4(CH3) ; port CH3
CH4: U5.5(CH4) ; port CH4
CH5: U5.6(CH5) ; port CH5
CH6: U5.7(CH6) ; port CH6
CH7: U5.8(CH7) ; port CH7
DIN: U5.17(DIN) ; port DIN
DOUT: U5.15(DOUT) ; port DOUT
SCLK: U5.19(SCLK) ; port SCLK
NetR6_1: R6.1 U5.10(~{SHDN})

Not connected (* = marked no-connect by the designer): U5 12(REFOUT)* 16(SSTRB)*

### Channels
ADC1: designators C3=C3#1 C4=C4#1 R6=R6#1 U5=ADC1; ports CH0=CH0 CH1=CH1 CH2=CH2 CH3=CH3 CH4=CH4 CH5=CH5 CH6=CH6 CH7=CH7 DIN=MOSI DOUT=MISO SCLK=SCK ~{CS}=~{SS_ADC1}
ADC2: designators C3=C3#2 C4=C4#2 R6=R6#2 U5=ADC2; ports CH0=CH0 CH1=CH1 CH2=CH2 CH3=CH3 CH4=CH4 CH5=CH5 CH6=CH6 CH7=CH7 DIN=MOSI DOUT=MISO SCLK=SCK ~{CS}=~{SS_ADC2}
ADC3: designators C3=C3#3 C4=C4#3 R6=R6#3 U5=ADC3; ports CH0=CH0 CH1=CH1 CH2=CH2 CH3=CH3 CH4=CH4 CH5=CH5 CH6=CH6 CH7=CH7 DIN=MOSI DOUT=MISO SCLK=SCK ~{CS}=~{SS_ADC3}
ADC4: designators C3=C3#4 C4=C4#4 R6=R6#4 U5=ADC4; ports CH0=CH0 CH1=CH1 CH2=CH2 CH3=CH3 CH4=CH4 CH5=CH5 CH6=CH6 CH7=CH7 DIN=MOSI DOUT=MISO SCLK=SCK ~{CS}=~{SS_ADC4}
ADC5: designators C3=C3#5 C4=C4#5 R6=R6#5 U5=ADC5; ports CH0=CH0 CH1=CH1 CH2=CH2 CH3=CH3 CH4=CH4 CH5=CH5 CH6=CH6 CH7=CH7 DIN=MOSI DOUT=MISO SCLK=SCK ~{CS}=~{SS_ADC5}
ADC6: designators C3=C3#6 C4=C4#6 R6=R6#6 U5=ADC6; ports CH0=CH0 CH1=CH1 CH2=CH2 CH3=CH3 CH4=CH4 CH5=CH5 CH6=CH6 CH7=CH7 DIN=MOSI DOUT=MISO SCLK=SCK ~{CS}=~{SS_ADC6}

### Library data of the parts
C3 = CAP 100nF: as C7 on sheet SensorControl; Supplier: Farnell; Value: 100nF
C4 = CAP 1uF: Capacitor; Tolerance: +80%/-20%; Voltage: 25V; Reference: 1828853; Name: SMD Multilayer Ceramic Capacitor, 0805; Supplier: Farnell; Value: 1uF
R6 = RES 1K: Resistor; Tolerance: 5%; Power: 125mW; Name: YAGEO (PHYCOMP)  RC0805JR-071KL  SMD Chip Resistor, Thick Film, 1 kohm; Reference: 9234004; Supplier: Farnell; Value: 1K
U5 = MAX1110CAP+: Analogue to Digital Converter, Low Power, 8 bit, 50 kSPS, Single, 2.7 V, 5.5 V, SSOP

## Sheet LightSensors.SchDoc
size A4
Used 48 times, as channels LightSensor1, LightSensor2, LightSensor3, LightSensor4, LightSensor5, LightSensor6, LightSensor7, LightSensor8, LightSensor9, LightSensor10, LightSensor11, LightSensor12, LightSensor13, LightSensor14, LightSensor15, LightSensor16, LightSensor17, LightSensor18, LightSensor19, LightSensor20, LightSensor21, LightSensor22, LightSensor23, LightSensor24, LightSensor25, LightSensor26, LightSensor27, LightSensor28, LightSensor29, LightSensor30, LightSensor31, LightSensor32, LightSensor33, LightSensor34, LightSensor35, LightSensor36, LightSensor37, LightSensor38, LightSensor39, LightSensor40, LightSensor41, LightSensor42, LightSensor43, LightSensor44, LightSensor45, LightSensor46, LightSensor47, LightSensor48. Parts and nets are listed once, with the designators drawn on the sheet.
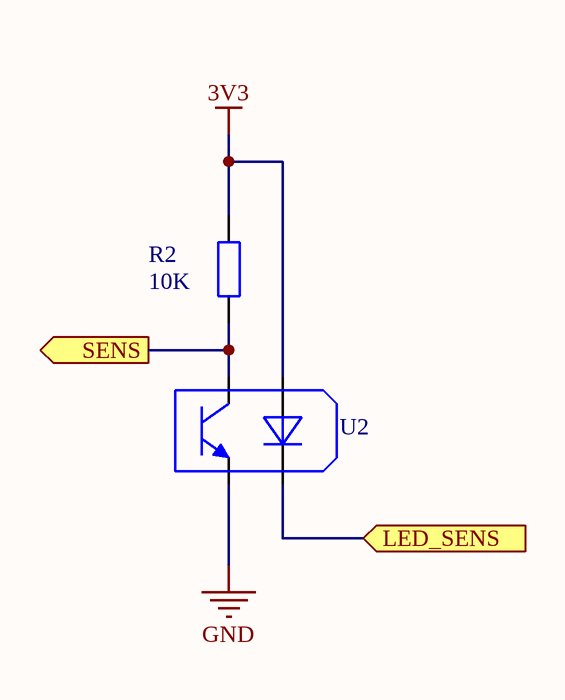
[diagram p6: LightSensors.SchDoc]

### Parts
R2  10K  [FP_0805_RES]
U2  TCRT5000  [TCRT5000_NO_HOLE]  (value not drawn)

### Ports
LED_SENS (in), SENS (out)

### Nets
3V3: R2.2 U2.A
GND: U2.E
LED_SENS: U2.K ; port LED_SENS
SENS: R2.1 U2.C ; port SENS

### Channels
LightSensor1: designators R2=R2_LightSensor1 U2=1#2; ports LED_SENS=LED_SENS1 SENS=CH0
LightSensor2: designators R2=R2_LightSensor2 U2=2; ports LED_SENS=LED_SENS2 SENS=CH1
LightSensor3: designators R2=R2_LightSensor3 U2=3; ports LED_SENS=LED_SENS3 SENS=CH2
LightSensor4: designators R2=R2_LightSensor4 U2=4; ports LED_SENS=LED_SENS4 SENS=CH3
LightSensor5: designators R2=R2_LightSensor5 U2=5; ports LED_SENS=LED_SENS5 SENS=CH4
LightSensor6: designators R2=R2_LightSensor6 U2=6; ports LED_SENS=LED_SENS6 SENS=CH5
LightSensor7: designators R2=R2_LightSensor7 U2=7; ports LED_SENS=LED_SENS7 SENS=CH6
LightSensor8: designators R2=R2_LightSensor8 U2=8; ports LED_SENS=LED_SENS8 SENS=CH7
LightSensor9: designators R2=R2_LightSensor9 U2=9; ports LED_SENS=LED_SENS9 SENS=CH0
LightSensor10: designators R2=R2_LightSensor10 U2=10; ports LED_SENS=LED_SENS10 SENS=CH1
LightSensor11: designators R2=R2_LightSensor11 U2=11; ports LED_SENS=LED_SENS11 SENS=CH2
LightSensor12: designators R2=R2_LightSensor12 U2=12; ports LED_SENS=LED_SENS12 SENS=CH3
LightSensor13: designators R2=R2_LightSensor13 U2=13; ports LED_SENS=LED_SENS13 SENS=CH4
LightSensor14: designators R2=R2_LightSensor14 U2=14; ports LED_SENS=LED_SENS14 SENS=CH5
LightSensor15: designators R2=R2_LightSensor15 U2=15; ports LED_SENS=LED_SENS15 SENS=CH6
LightSensor16: designators R2=R2_LightSensor16 U2=16; ports LED_SENS=LED_SENS16 SENS=CH7
LightSensor17: designators R2=R2_LightSensor17 U2=17; ports LED_SENS=LED_SENS17 SENS=CH0
LightSensor18: designators R2=R2_LightSensor18 U2=18; ports LED_SENS=LED_SENS18 SENS=CH1
LightSensor19: designators R2=R2_LightSensor19 U2=19; ports LED_SENS=LED_SENS19 SENS=CH2
LightSensor20: designators R2=R2_LightSensor20 U2=20; ports LED_SENS=LED_SENS20 SENS=CH3
LightSensor21: designators R2=R2_LightSensor21 U2=21; ports LED_SENS=LED_SENS21 SENS=CH4
LightSensor22: designators R2=R2_LightSensor22 U2=22; ports LED_SENS=LED_SENS22 SENS=CH5
LightSensor23: designators R2=R2_LightSensor23 U2=23; ports LED_SENS=LED_SENS23 SENS=CH6
LightSensor24: designators R2=R2_LightSensor24 U2=24; ports LED_SENS=LED_SENS24 SENS=CH7
LightSensor25: designators R2=R2_LightSensor25 U2=25; ports LED_SENS=LED_SENS25 SENS=CH0
LightSensor26: designators R2=R2_LightSensor26 U2=26; ports LED_SENS=LED_SENS26 SENS=CH1
LightSensor27: designators R2=R2_LightSensor27 U2=27; ports LED_SENS=LED_SENS27 SENS=CH2
LightSensor28: designators R2=R2_LightSensor28 U2=28; ports LED_SENS=LED_SENS28 SENS=CH3
LightSensor29: designators R2=R2_LightSensor29 U2=29; ports LED_SENS=LED_SENS29 SENS=CH4
LightSensor30: designators R2=R2_LightSensor30 U2=30; ports LED_SENS=LED_SENS30 SENS=CH5
LightSensor31: designators R2=R2_LightSensor31 U2=31; ports LED_SENS=LED_SENS31 SENS=CH6
LightSensor32: designators R2=R2_LightSensor32 U2=32; ports LED_SENS=LED_SENS32 SENS=CH7
LightSensor33: designators R2=R2_LightSensor33 U2=33; ports LED_SENS=LED_SENS33 SENS=CH0
LightSensor34: designators R2=R2_LightSensor34 U2=34; ports LED_SENS=LED_SENS34 SENS=CH1
LightSensor35: designators R2=R2_LightSensor35 U2=35; ports LED_SENS=LED_SENS35 SENS=CH2
LightSensor36: designators R2=R2_LightSensor36 U2=36; ports LED_SENS=LED_SENS36 SENS=CH3
LightSensor37: designators R2=R2_LightSensor37 U2=37; ports LED_SENS=LED_SENS37 SENS=CH4
LightSensor38: designators R2=R2_LightSensor38 U2=38; ports LED_SENS=LED_SENS38 SENS=CH5
LightSensor39: designators R2=R2_LightSensor39 U2=39; ports LED_SENS=LED_SENS39 SENS=CH6
LightSensor40: designators R2=R2_LightSensor40 U2=40; ports LED_SENS=LED_SENS40 SENS=CH7
LightSensor41: designators R2=R2_LightSensor41 U2=41; ports LED_SENS=LED_SENS41 SENS=CH0
LightSensor42: designators R2=R2_LightSensor42 U2=42; ports LED_SENS=LED_SENS42 SENS=CH1
LightSensor43: designators R2=R2_LightSensor43 U2=43; ports LED_SENS=LED_SENS43 SENS=CH2
LightSensor44: designators R2=R2_LightSensor44 U2=44; ports LED_SENS=LED_SENS44 SENS=CH3
LightSensor45: designators R2=R2_LightSensor45 U2=45; ports LED_SENS=LED_SENS45 SENS=CH4
LightSensor46: designators R2=R2_LightSensor46 U2=46; ports LED_SENS=LED_SENS46 SENS=CH5
LightSensor47: designators R2=R2_LightSensor47 U2=47; ports LED_SENS=LED_SENS47 SENS=CH6
LightSensor48: designators R2=R2_LightSensor48 U2=48; ports LED_SENS=LED_SENS48 SENS=CH7

### Library data of the parts
R2 = RES 10K: as R_boot on sheet microcontroller; Supplier: Farnell; Value: 10K
U2 = TCRT5000: Reflective Photo Interrupter, Phototransistor, Through Hole, 15 mm, 60 mA, 5 Vr, 1.25 Vf

## Nets that join several sheets
3V3: OPTO1 (C7#1.2 OPTO1.24), OPTO2 (C7#2.2 OPTO2.24), IND1 (C1#1.2 IND1.24), IND2 (C1#2.2 IND2.24), microcontroller (15 pins), ADC1 (5 pins), ADC2 (5 pins), ADC3 (5 pins), ADC4 (5 pins), LightSensor1 (1#2.A R2_LightSensor1.2), LightSensor2 (2.A R2_LightSensor2.2), LightSensor3 (3.A R2_LightSensor3.2), LightSensor4 (4.A R2_LightSensor4.2), LightSensor5 (5.A R2_LightSensor5.2), LightSensor6 (6.A R2_LightSensor6.2), LightSensor7 (7.A R2_LightSensor7.2), LightSensor8 (8.A R2_LightSensor8.2), LightSensor9 (9.A R2_LightSensor9.2), LightSensor10 (10.A R2_LightSensor10.2), LightSensor11 (11.A R2_LightSensor11.2), LightSensor12 (12.A R2_LightSensor12.2), LightSensor13 (13.A R2_LightSensor13.2), LightSensor14 (14.A R2_LightSensor14.2), LightSensor15 (15.A R2_LightSensor15.2), LightSensor16 (16.A R2_LightSensor16.2), LightSensor17 (17.A R2_LightSensor17.2), LightSensor18 (18.A R2_LightSensor18.2), LightSensor19 (19.A R2_LightSensor19.2), LightSensor20 (20.A R2_LightSensor20.2), LightSensor21 (21.A R2_LightSensor21.2), LightSensor22 (22.A R2_LightSensor22.2), LightSensor23 (23.A R2_LightSensor23.2), LightSensor24 (24.A R2_LightSensor24.2), LightSensor25 (25.A R2_LightSensor25.2), LightSensor26 (26.A R2_LightSensor26.2), LightSensor27 (27.A R2_LightSensor27.2), LightSensor28 (28.A R2_LightSensor28.2), LightSensor29 (29.A R2_LightSensor29.2), LightSensor30 (30.A R2_LightSensor30.2), LightSensor31 (31.A R2_LightSensor31.2), LightSensor32 (32.A R2_LightSensor32.2), LightSensor33 (33.A R2_LightSensor33.2), LightSensor34 (34.A R2_LightSensor34.2), LightSensor35 (35.A R2_LightSensor35.2), LightSensor36 (36.A R2_LightSensor36.2), LightSensor37 (37.A R2_LightSensor37.2), LightSensor38 (38.A R2_LightSensor38.2), LightSensor39 (39.A R2_LightSensor39.2), LightSensor40 (40.A R2_LightSensor40.2), LightSensor41 (41.A R2_LightSensor41.2), LightSensor42 (42.A R2_LightSensor42.2), LightSensor43 (43.A R2_LightSensor43.2), LightSensor44 (44.A R2_LightSensor44.2), LightSensor45 (45.A R2_LightSensor45.2), LightSensor46 (46.A R2_LightSensor46.2), LightSensor47 (47.A R2_LightSensor47.2), LightSensor48 (48.A R2_LightSensor48.2), OPTO3 (C7#3.2 OPTO3.24), IND3 (C1#3.2 IND3.24), ADC5 (5 pins), ADC6 (5 pins)
GND: OPTO1 (C7#1.1 OPTO1.1 R3#1.2), OPTO2 (C7#2.1 OPTO2.1 R3#2.2), IND1 (C1#1.1 IND1.1 R1#1.2), IND2 (C1#2.1 IND2.1 R1#2.2), microcontroller (26 pins), ADC1 (5 pins), ADC2 (5 pins), ADC3 (5 pins), ADC4 (5 pins), LightSensor1 (1#2.E), LightSensor2 (2.E), LightSensor3 (3.E), LightSensor4 (4.E), LightSensor5 (5.E), LightSensor6 (6.E), LightSensor7 (7.E), LightSensor8 (8.E), LightSensor9 (9.E), LightSensor10 (10.E), LightSensor11 (11.E), LightSensor12 (12.E), LightSensor13 (13.E), LightSensor14 (14.E), LightSensor15 (15.E), LightSensor16 (16.E), LightSensor17 (17.E), LightSensor18 (18.E), LightSensor19 (19.E), LightSensor20 (20.E), LightSensor21 (21.E), LightSensor22 (22.E), LightSensor23 (23.E), LightSensor24 (24.E), LightSensor25 (25.E), LightSensor26 (26.E), LightSensor27 (27.E), LightSensor28 (28.E), LightSensor29 (29.E), LightSensor30 (30.E), LightSensor31 (31.E), LightSensor32 (32.E), LightSensor33 (33.E), LightSensor34 (34.E), LightSensor35 (35.E), LightSensor36 (36.E), LightSensor37 (37.E), LightSensor38 (38.E), LightSensor39 (39.E), LightSensor40 (40.E), LightSensor41 (41.E), LightSensor42 (42.E), LightSensor43 (43.E), LightSensor44 (44.E), LightSensor45 (45.E), LightSensor46 (46.E), LightSensor47 (47.E), LightSensor48 (48.E), OPTO3 (C7#3.1 OPTO3.1 R3#3.2), IND3 (C1#3.1 IND3.1 R1#3.2), ADC5 (5 pins), ADC6 (5 pins)
CH0: ADC1 (ADC1.1), LightSensor1 (1#2.C R2_LightSensor1.1)
CH0: ADC2 (ADC2.1), LightSensor9 (9.C R2_LightSensor9.1)
CH0: ADC3 (ADC3.1), LightSensor17 (17.C R2_LightSensor17.1)
CH0: ADC4 (ADC4.1), LightSensor25 (25.C R2_LightSensor25.1)
CH0: LightSensor33 (33.C R2_LightSensor33.1), ADC5 (ADC5.1)
CH0: LightSensor41 (41.C R2_LightSensor41.1), ADC6 (ADC6.1)
CH1: ADC1 (ADC1.2), LightSensor2 (2.C R2_LightSensor2.1)
CH1: ADC2 (ADC2.2), LightSensor10 (10.C R2_LightSensor10.1)
CH1: ADC3 (ADC3.2), LightSensor18 (18.C R2_LightSensor18.1)
CH1: ADC4 (ADC4.2), LightSensor26 (26.C R2_LightSensor26.1)
CH1: LightSensor34 (34.C R2_LightSensor34.1), ADC5 (ADC5.2)
CH1: LightSensor42 (42.C R2_LightSensor42.1), ADC6 (ADC6.2)
CH2: ADC1 (ADC1.3), LightSensor3 (3.C R2_LightSensor3.1)
CH2: ADC2 (ADC2.3), LightSensor11 (11.C R2_LightSensor11.1)
CH2: ADC3 (ADC3.3), LightSensor19 (19.C R2_LightSensor19.1)
CH2: ADC4 (ADC4.3), LightSensor27 (27.C R2_LightSensor27.1)
CH2: LightSensor35 (35.C R2_LightSensor35.1), ADC5 (ADC5.3)
CH2: LightSensor43 (43.C R2_LightSensor43.1), ADC6 (ADC6.3)
CH3: ADC1 (ADC1.4), LightSensor4 (4.C R2_LightSensor4.1)
CH3: ADC2 (ADC2.4), LightSensor12 (12.C R2_LightSensor12.1)
CH3: ADC3 (ADC3.4), LightSensor20 (20.C R2_LightSensor20.1)
CH3: ADC4 (ADC4.4), LightSensor28 (28.C R2_LightSensor28.1)
CH3: LightSensor36 (36.C R2_LightSensor36.1), ADC5 (ADC5.4)
CH3: LightSensor44 (44.C R2_LightSensor44.1), ADC6 (ADC6.4)
CH4: ADC1 (ADC1.5), LightSensor5 (5.C R2_LightSensor5.1)
CH4: ADC2 (ADC2.5), LightSensor13 (13.C R2_LightSensor13.1)
CH4: ADC3 (ADC3.5), LightSensor21 (21.C R2_LightSensor21.1)
CH4: ADC4 (ADC4.5), LightSensor29 (29.C R2_LightSensor29.1)
CH4: LightSensor37 (37.C R2_LightSensor37.1), ADC5 (ADC5.5)
CH4: LightSensor45 (45.C R2_LightSensor45.1), ADC6 (ADC6.5)
CH5: ADC1 (ADC1.6), LightSensor6 (6.C R2_LightSensor6.1)
CH5: ADC2 (ADC2.6), LightSensor14 (14.C R2_LightSensor14.1)
CH5: ADC3 (ADC3.6), LightSensor22 (22.C R2_LightSensor22.1)
CH5: ADC4 (ADC4.6), LightSensor30 (30.C R2_LightSensor30.1)
CH5: LightSensor38 (38.C R2_LightSensor38.1), ADC5 (ADC5.6)
CH5: LightSensor46 (46.C R2_LightSensor46.1), ADC6 (ADC6.6)
CH6: ADC1 (ADC1.7), LightSensor7 (7.C R2_LightSensor7.1)
CH6: ADC2 (ADC2.7), LightSensor15 (15.C R2_LightSensor15.1)
CH6: ADC3 (ADC3.7), LightSensor23 (23.C R2_LightSensor23.1)
CH6: ADC4 (ADC4.7), LightSensor31 (31.C R2_LightSensor31.1)
CH6: LightSensor39 (39.C R2_LightSensor39.1), ADC5 (ADC5.7)
CH6: LightSensor47 (47.C R2_LightSensor47.1), ADC6 (ADC6.7)
CH7: ADC1 (ADC1.8), LightSensor8 (8.C R2_LightSensor8.1)
CH7: ADC2 (ADC2.8), LightSensor16 (16.C R2_LightSensor16.1)
CH7: ADC3 (ADC3.8), LightSensor24 (24.C R2_LightSensor24.1)
CH7: ADC4 (ADC4.8), LightSensor32 (32.C R2_LightSensor32.1)
CH7: LightSensor40 (40.C R2_LightSensor40.1), ADC5 (ADC5.8)
CH7: LightSensor48 (48.C R2_LightSensor48.1), ADC6 (ADC6.8)
LE_IND: IND1 (IND1.4), IND2 (IND2.4), microcontroller (1#1.9), IND3 (IND3.4)
LE_OPTO: OPTO1 (OPTO1.4), OPTO2 (OPTO2.4), microcontroller (1#1.11), OPTO3 (OPTO3.4)
LED_SENS1: OPTO1 (OPTO1.5), LightSensor1 (1#2.K)
LED_SENS2: OPTO1 (OPTO1.6), LightSensor2 (2.K)
LED_SENS3: OPTO1 (OPTO1.7), LightSensor3 (3.K)
LED_SENS4: OPTO1 (OPTO1.8), LightSensor4 (4.K)
LED_SENS5: OPTO1 (OPTO1.9), LightSensor5 (5.K)
LED_SENS6: OPTO1 (OPTO1.10), LightSensor6 (6.K)
LED_SENS7: OPTO1 (OPTO1.11), LightSensor7 (7.K)
LED_SENS8: OPTO1 (OPTO1.12), LightSensor8 (8.K)
LED_SENS9: OPTO1 (OPTO1.13), LightSensor9 (9.K)
LED_SENS10: OPTO1 (OPTO1.14), LightSensor10 (10.K)
LED_SENS11: OPTO1 (OPTO1.15), LightSensor11 (11.K)
LED_SENS12: OPTO1 (OPTO1.16), LightSensor12 (12.K)
LED_SENS13: OPTO1 (OPTO1.17), LightSensor13 (13.K)
LED_SENS14: OPTO1 (OPTO1.18), LightSensor14 (14.K)
LED_SENS15: OPTO1 (OPTO1.19), LightSensor15 (15.K)
LED_SENS16: OPTO1 (OPTO1.20), LightSensor16 (16.K)
LED_SENS17: OPTO2 (OPTO2.5), LightSensor17 (17.K)
LED_SENS18: OPTO2 (OPTO2.6), LightSensor18 (18.K)
LED_SENS19: OPTO2 (OPTO2.7), LightSensor19 (19.K)
LED_SENS20: OPTO2 (OPTO2.8), LightSensor20 (20.K)
LED_SENS21: OPTO2 (OPTO2.9), LightSensor21 (21.K)
LED_SENS22: OPTO2 (OPTO2.10), LightSensor22 (22.K)
LED_SENS23: OPTO2 (OPTO2.11), LightSensor23 (23.K)
LED_SENS24: OPTO2 (OPTO2.12), LightSensor24 (24.K)
LED_SENS25: OPTO2 (OPTO2.13), LightSensor25 (25.K)
LED_SENS26: OPTO2 (OPTO2.14), LightSensor26 (26.K)
LED_SENS27: OPTO2 (OPTO2.15), LightSensor27 (27.K)
LED_SENS28: OPTO2 (OPTO2.16), LightSensor28 (28.K)
LED_SENS29: OPTO2 (OPTO2.17), LightSensor29 (29.K)
LED_SENS30: OPTO2 (OPTO2.18), LightSensor30 (30.K)
LED_SENS31: OPTO2 (OPTO2.19), LightSensor31 (31.K)
LED_SENS32: OPTO2 (OPTO2.20), LightSensor32 (32.K)
LED_SENS33: LightSensor33 (33.K), OPTO3 (OPTO3.5)
LED_SENS34: LightSensor34 (34.K), OPTO3 (OPTO3.6)
LED_SENS35: LightSensor35 (35.K), OPTO3 (OPTO3.7)
LED_SENS36: LightSensor36 (36.K), OPTO3 (OPTO3.8)
LED_SENS37: LightSensor37 (37.K), OPTO3 (OPTO3.9)
LED_SENS38: LightSensor38 (38.K), OPTO3 (OPTO3.10)
LED_SENS39: LightSensor39 (39.K), OPTO3 (OPTO3.11)
LED_SENS40: LightSensor40 (40.K), OPTO3 (OPTO3.12)
LED_SENS41: LightSensor41 (41.K), OPTO3 (OPTO3.13)
LED_SENS42: LightSensor42 (42.K), OPTO3 (OPTO3.14)
LED_SENS43: LightSensor43 (43.K), OPTO3 (OPTO3.15)
LED_SENS44: LightSensor44 (44.K), OPTO3 (OPTO3.16)
LED_SENS45: LightSensor45 (45.K), OPTO3 (OPTO3.17)
LED_SENS46: LightSensor46 (46.K), OPTO3 (OPTO3.18)
LED_SENS47: LightSensor47 (47.K), OPTO3 (OPTO3.19)
LED_SENS48: LightSensor48 (48.K), OPTO3 (OPTO3.20)
MISO: microcontroller (1#1.22), ADC1 (ADC1.15), ADC2 (ADC2.15), ADC3 (ADC3.15), ADC4 (ADC4.15), ADC5 (ADC5.15), ADC6 (ADC6.15)
MOSI: OPTO1 (OPTO1.2), microcontroller (1#1.23), ADC1 (ADC1.17), ADC2 (ADC2.17), ADC3 (ADC3.17), ADC4 (ADC4.17), IND3 (IND3.2), ADC5 (ADC5.17), ADC6 (ADC6.17)
NetIND1_2: IND1 (IND1.2), IND2 (IND2.22)
NetIND2_2: IND2 (IND2.2), IND3 (IND3.22)
NetOPTO1_22: OPTO1 (OPTO1.22), OPTO2 (OPTO2.2)
NetOPTO2_22: OPTO2 (OPTO2.22), OPTO3 (OPTO3.2)
~{OE_IND}: IND1 (IND1.21), IND2 (IND2.21), microcontroller (1#1.8), IND3 (IND3.21)
~{OE_OPTO}: OPTO1 (OPTO1.21), OPTO2 (OPTO2.21), microcontroller (1#1.10), OPTO3 (OPTO3.21)
~{SS_ADC1}: microcontroller (1#1.37), ADC1 (ADC1.18)
~{SS_ADC2}: microcontroller (1#1.55), ADC2 (ADC2.18)
~{SS_ADC3}: microcontroller (1#1.50), ADC3 (ADC3.18)
~{SS_ADC4}: microcontroller (1#1.4), ADC4 (ADC4.18)
~{SS_ADC5}: microcontroller (1#1.3), ADC5 (ADC5.18)
~{SS_ADC6}: microcontroller (1#1.2), ADC6 (ADC6.18)
SCK: OPTO1 (OPTO1.3), OPTO2 (OPTO2.3), IND1 (IND1.3), IND2 (IND2.3), microcontroller (1#1.21), ADC1 (ADC1.19), ADC2 (ADC2.19), ADC3 (ADC3.19), ADC4 (ADC4.19), OPTO3 (OPTO3.3), IND3 (IND3.3), ADC5 (ADC5.19), ADC6 (ADC6.19)